# EAGLE schematic Avalon16 (EAGLE 5.12)
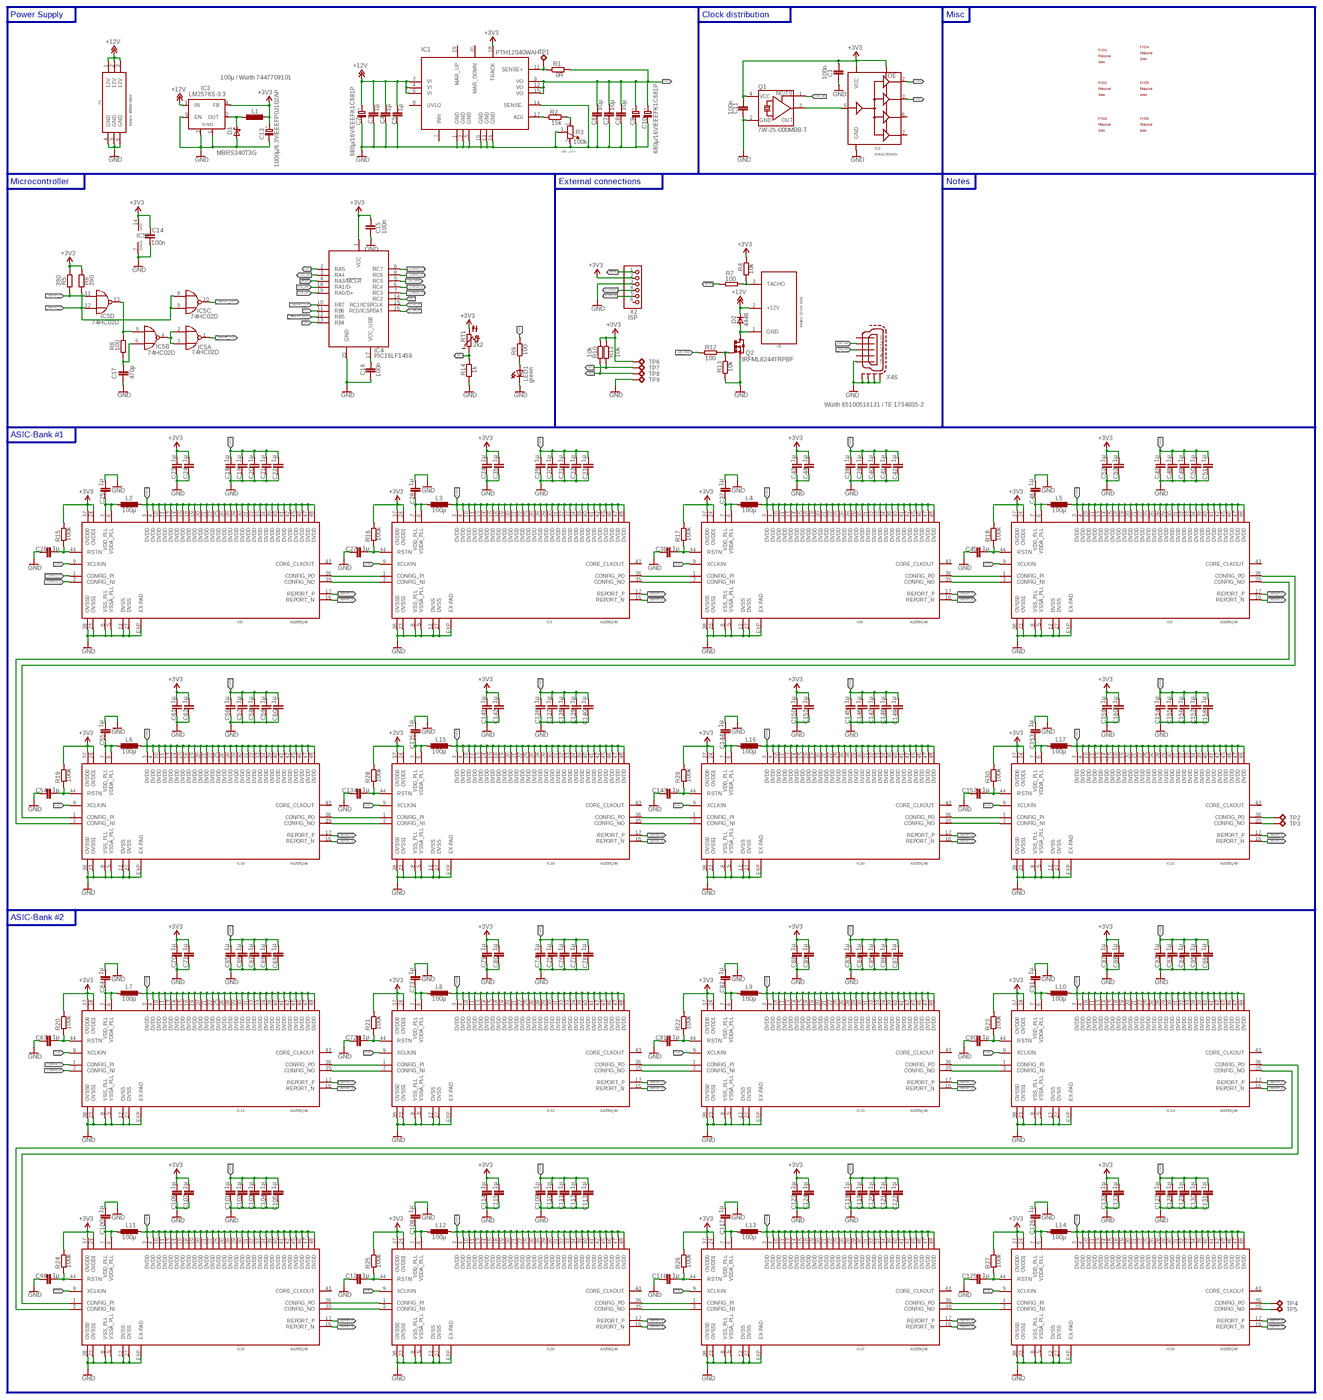
[diagram p0: schematic, sheet 1, overview]
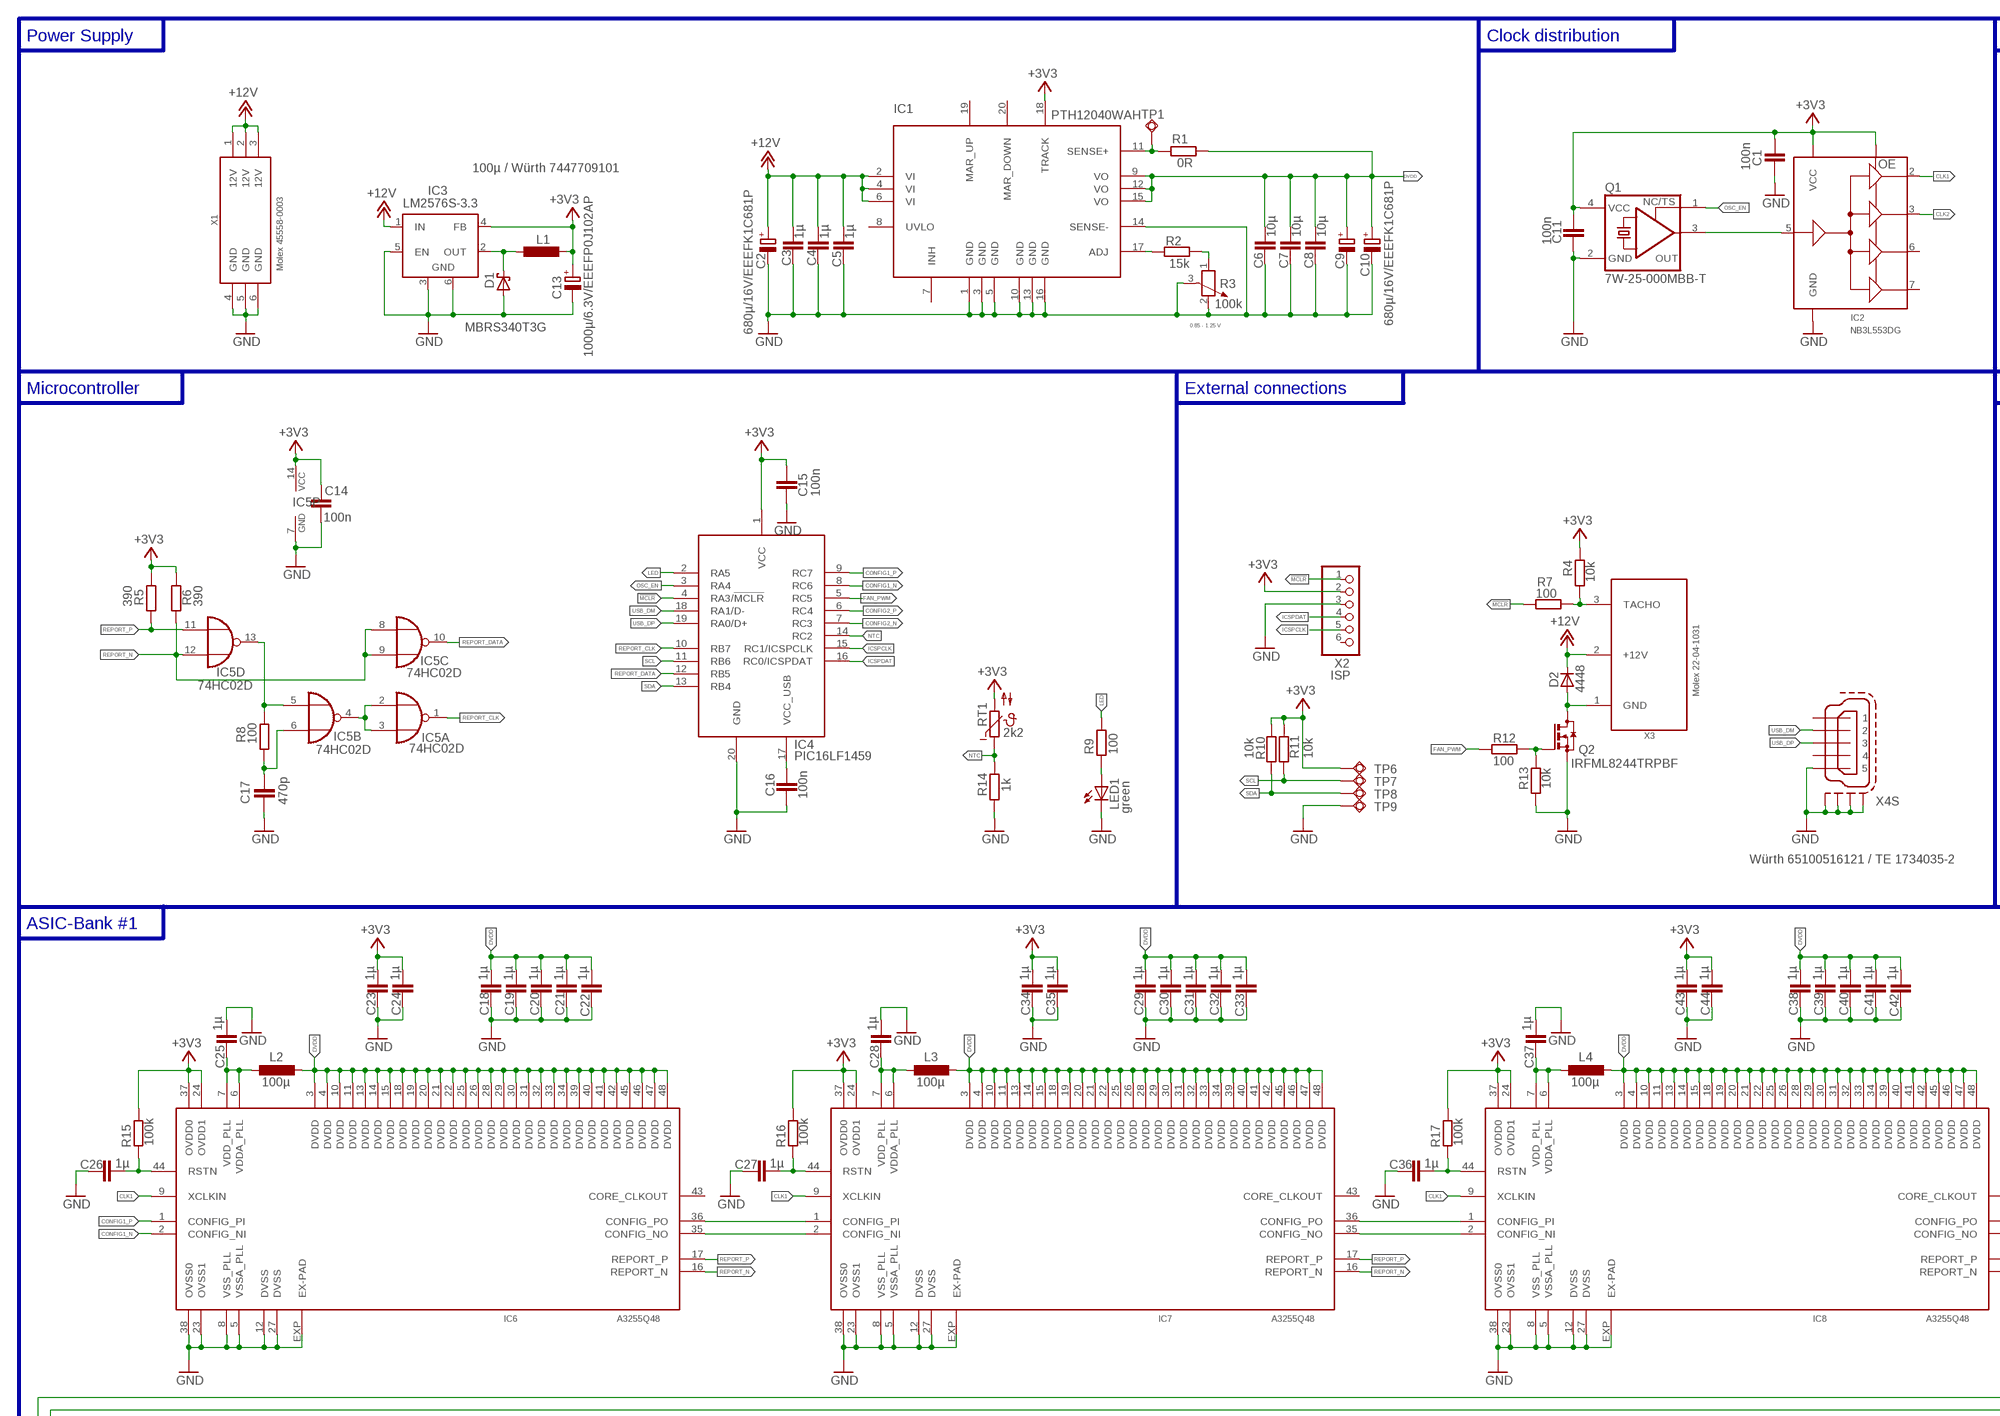
[diagram p1: schematic, sheet 1, part 1 of 4]
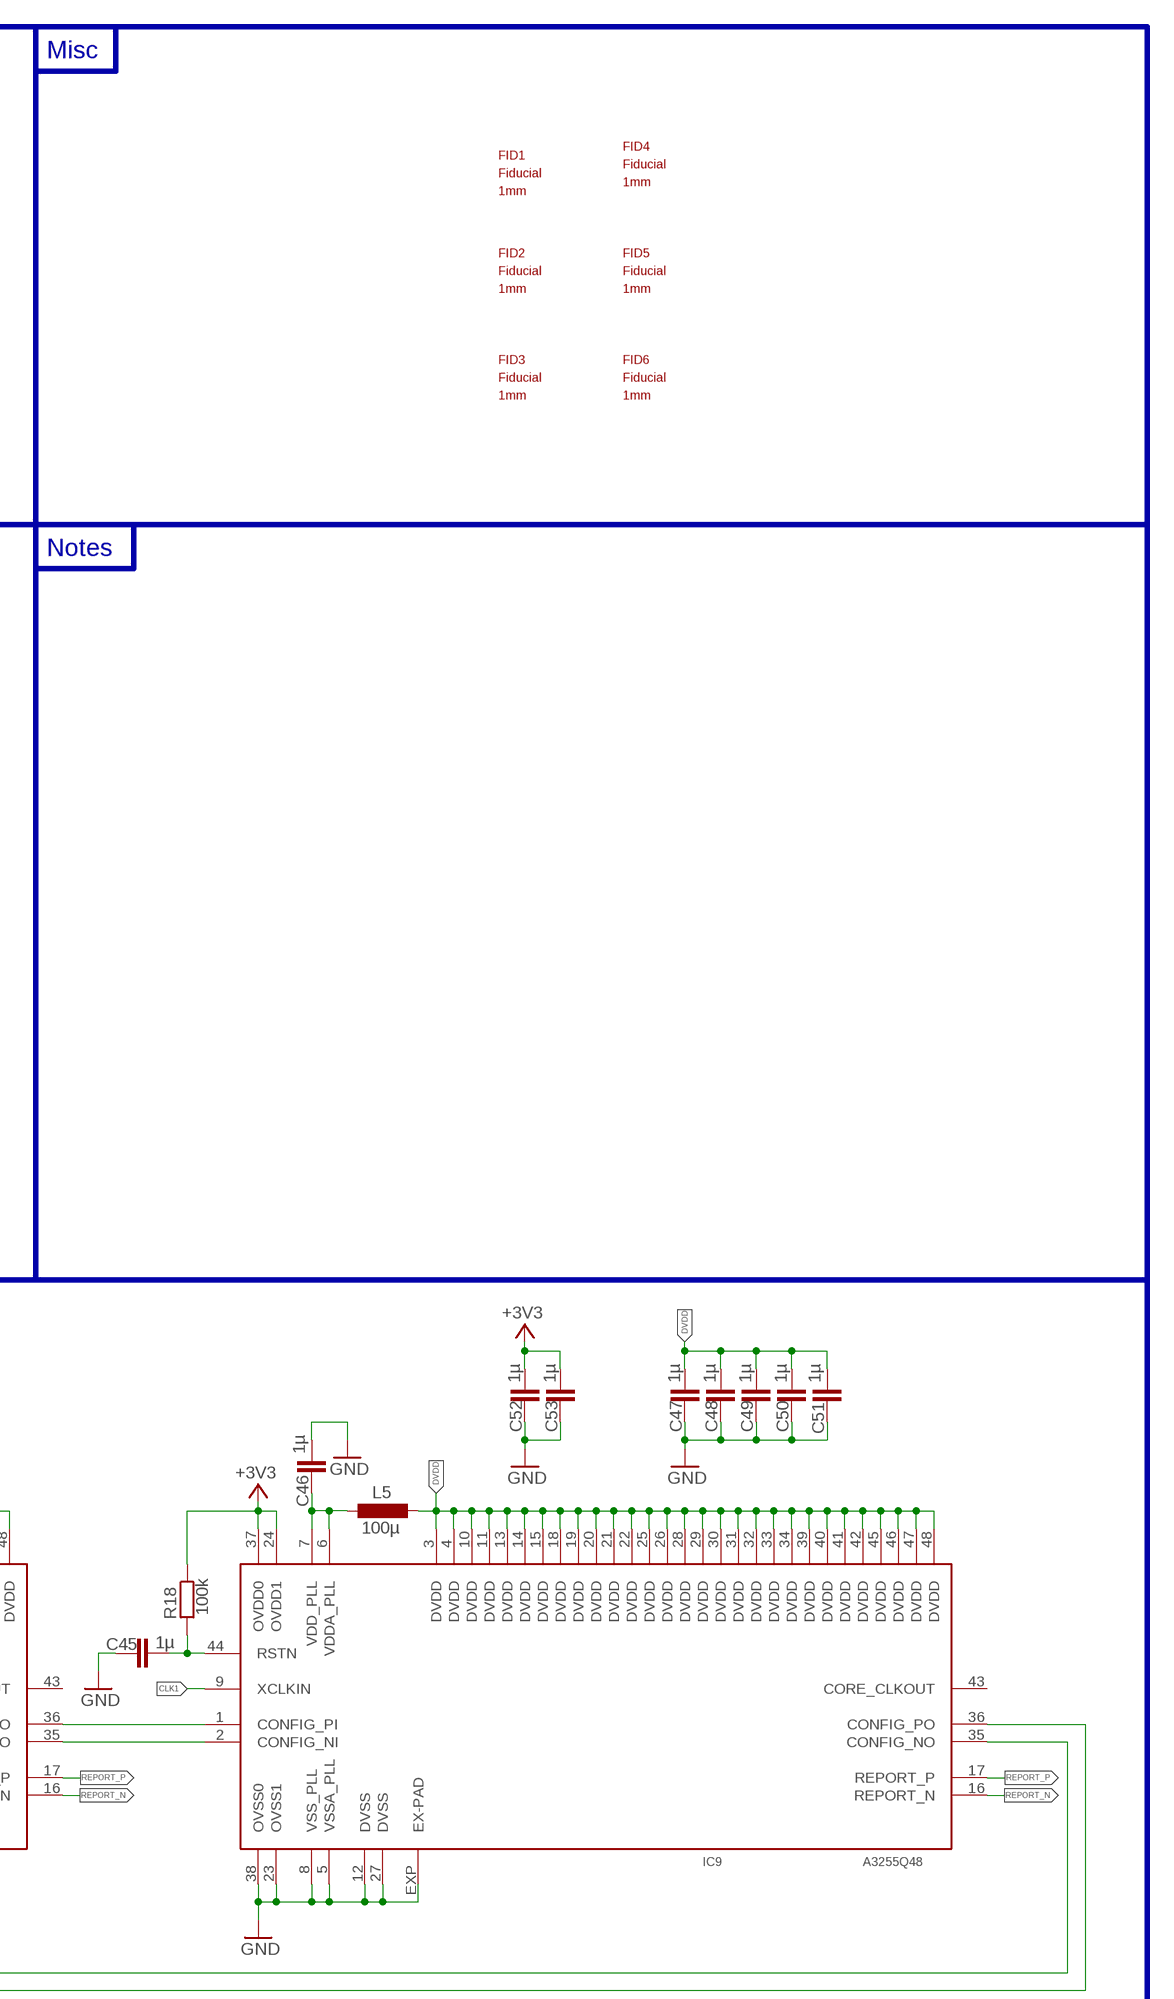
[diagram p2: schematic, sheet 1, part 2 of 4]
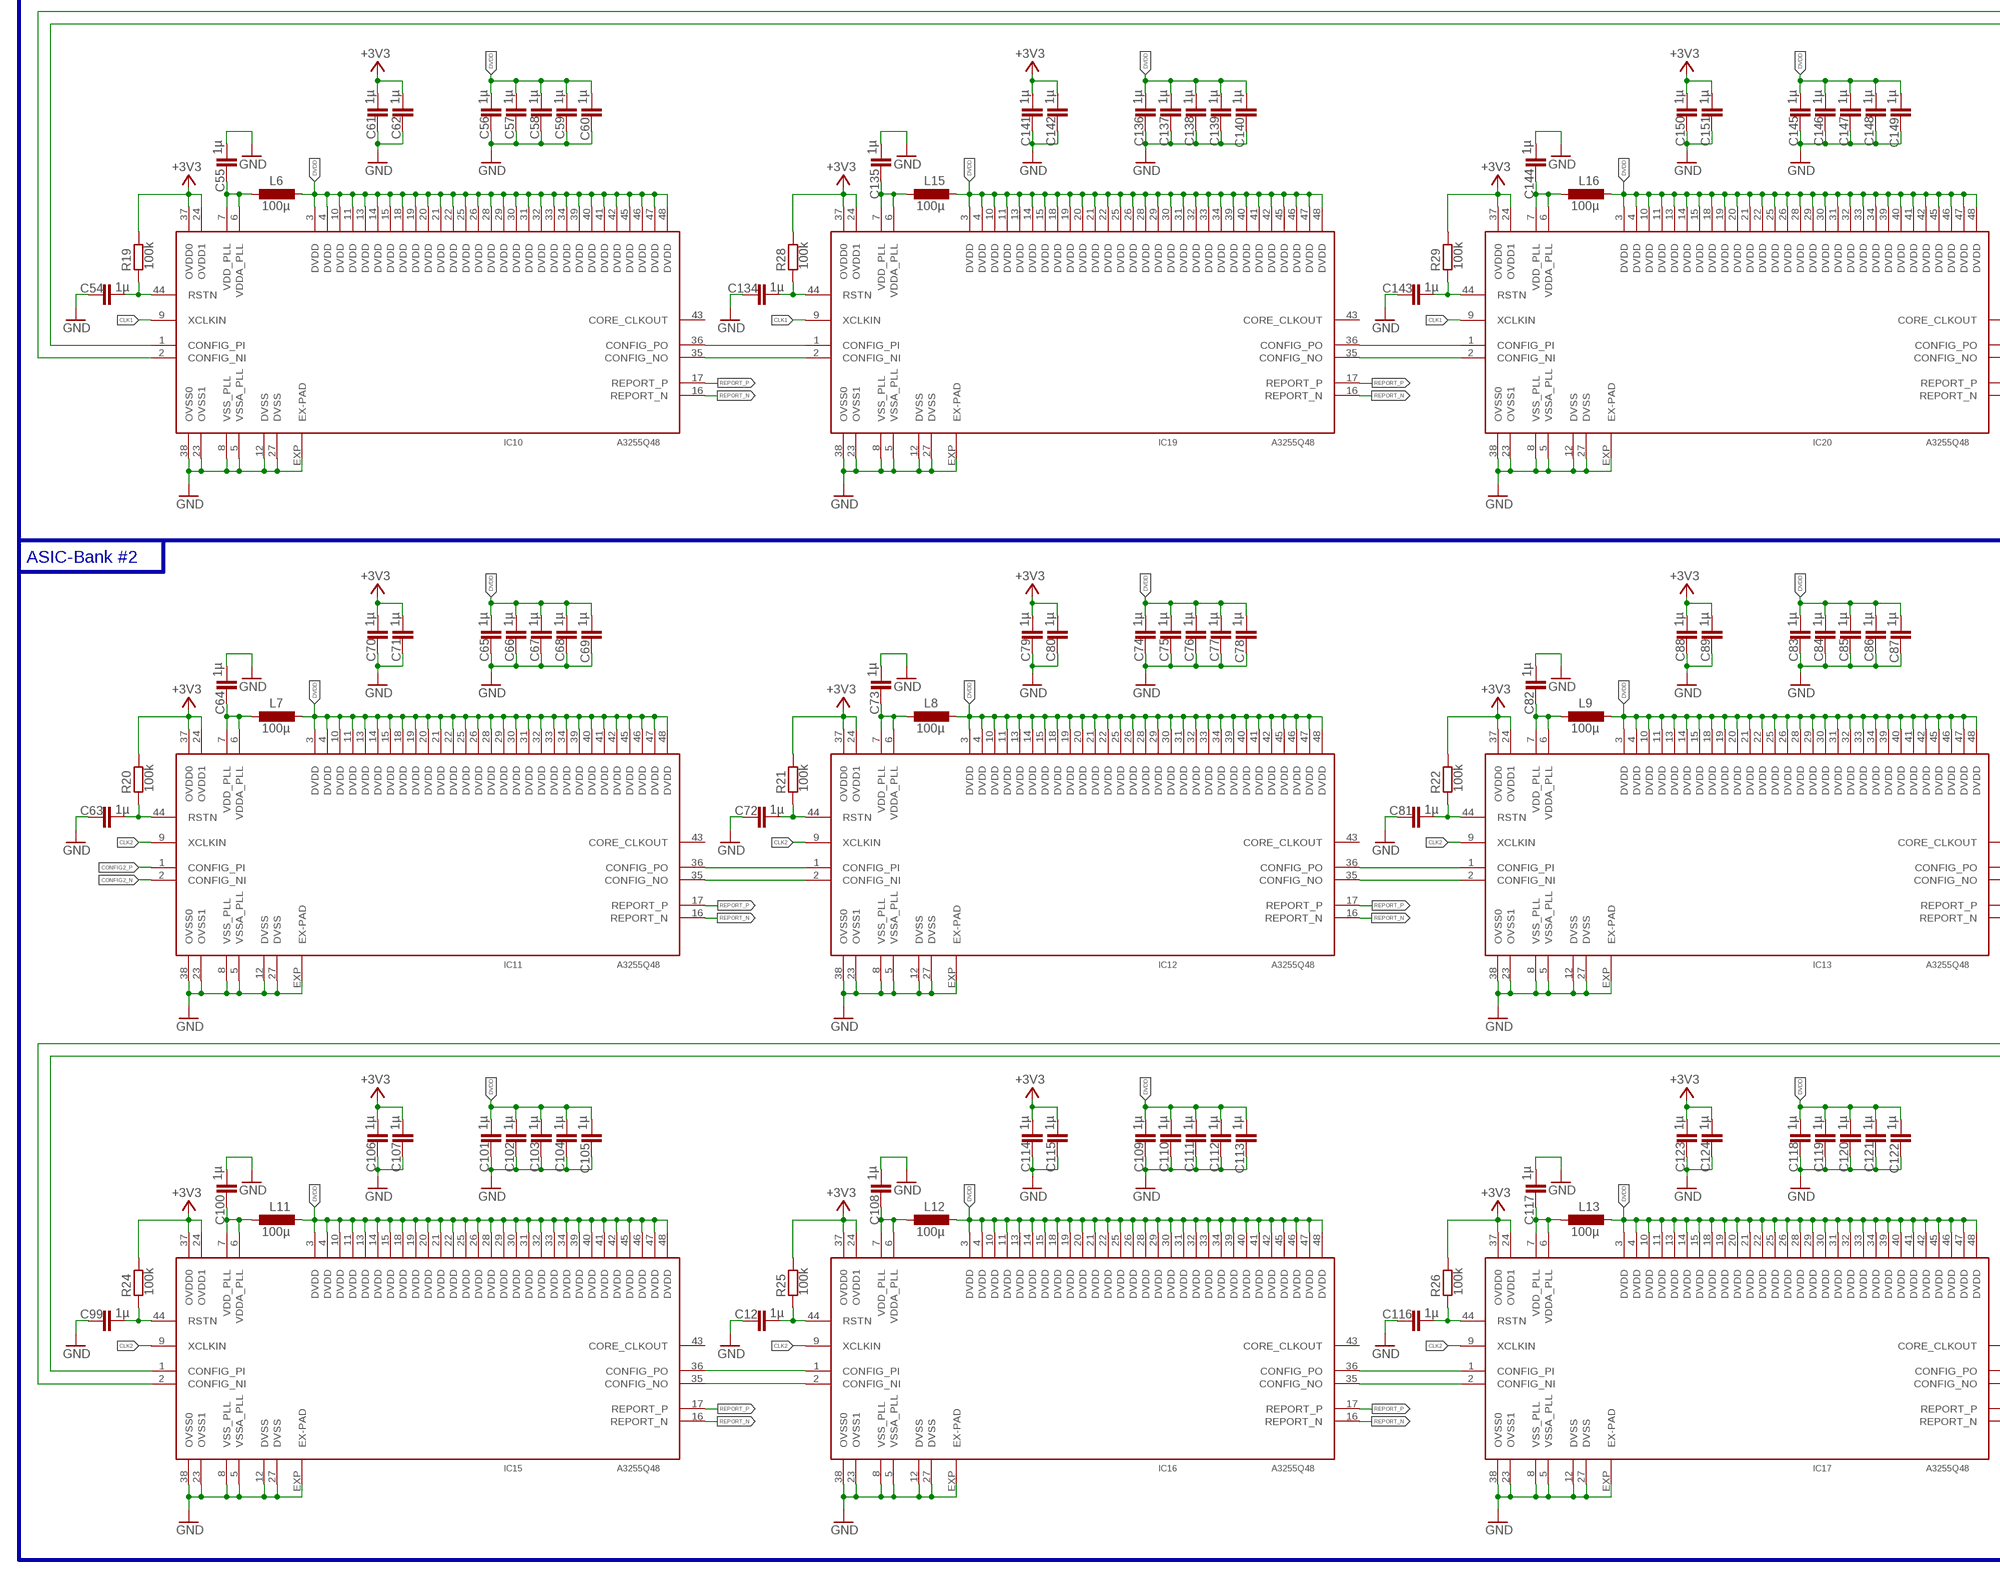
[diagram p3: schematic, sheet 1, part 3 of 4]
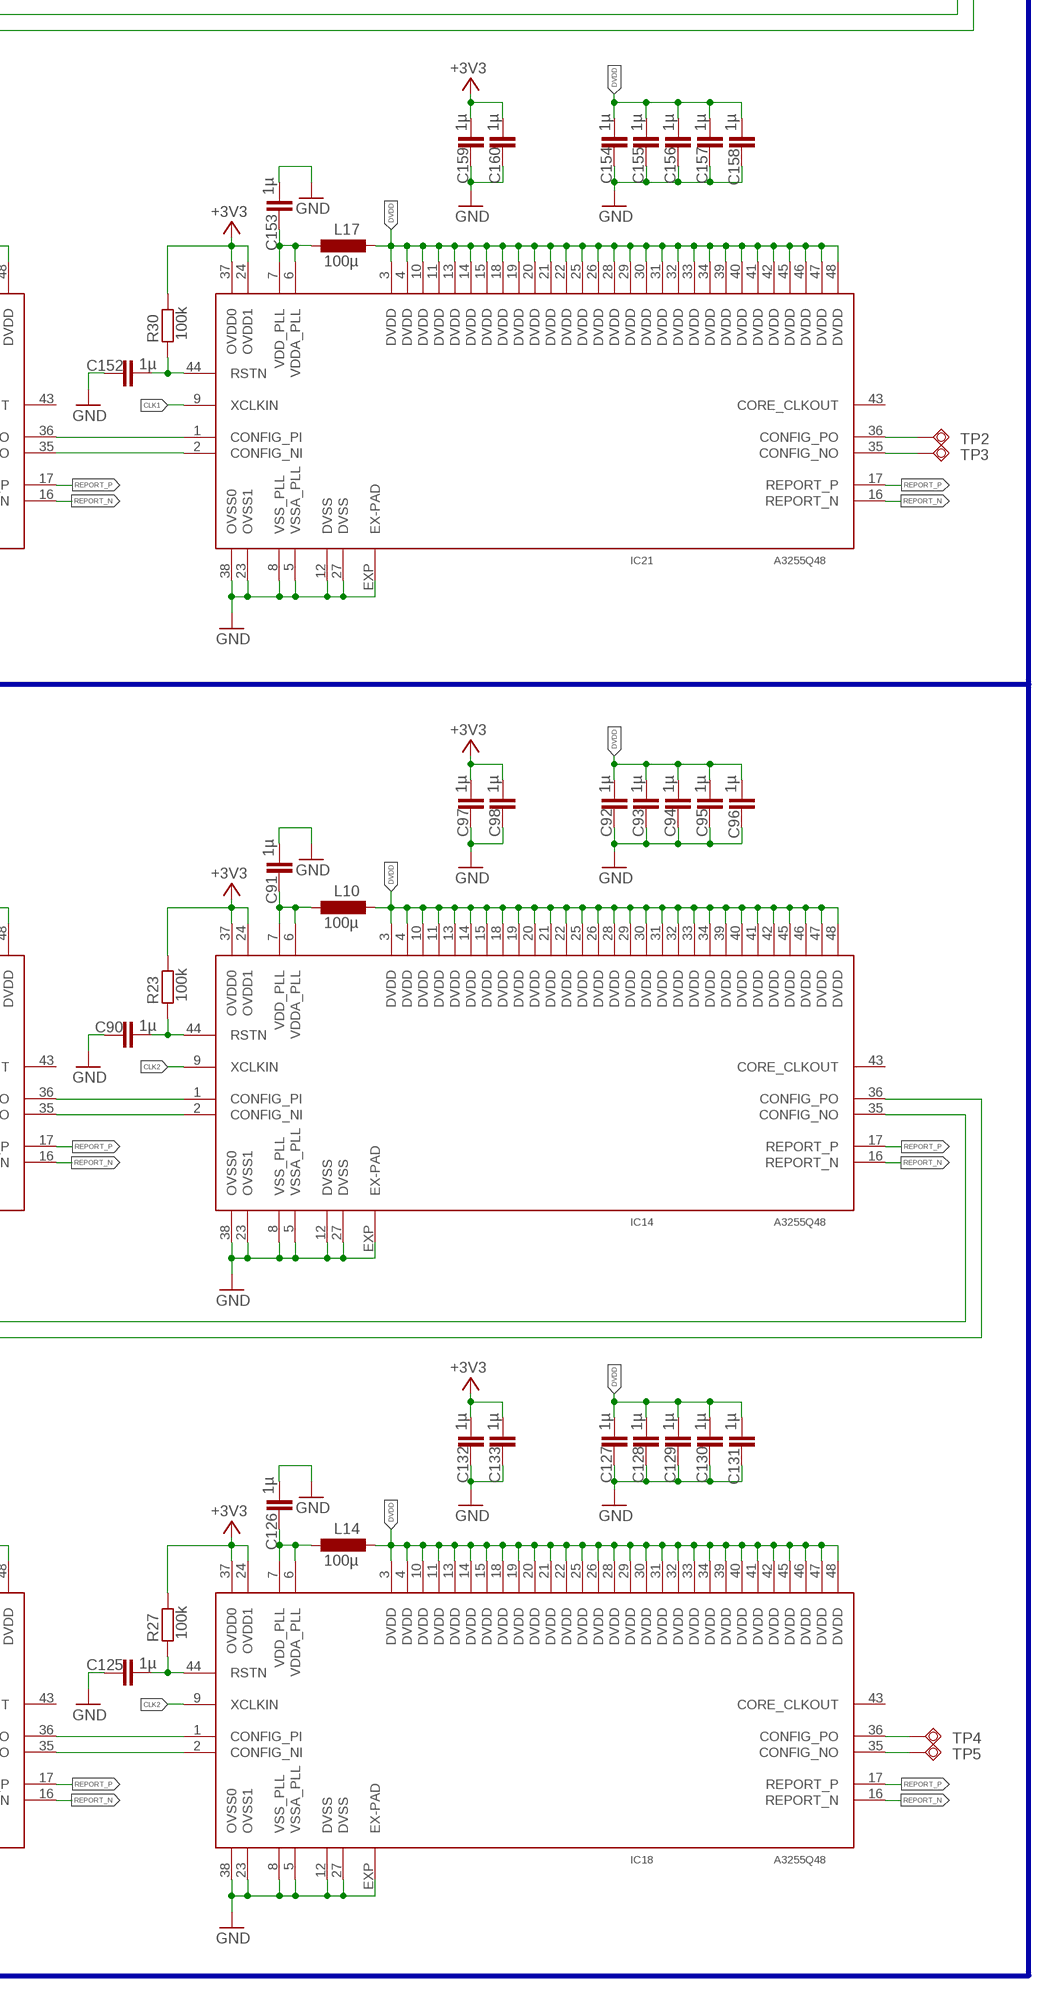
[diagram p4: schematic, sheet 1, part 4 of 4]

## Parts
C1  100n  C-EUC0805  [C0805]
C2  680µ/16V/EEEFK1C681P  CPOL-EUG  [PANASONIC_G]
C3  1µ  C-EUC0805  [C0805]
C4  1µ  C-EUC0805  [C0805]
C5  1µ  C-EUC0805  [C0805]
C6  10µ  C-EUC0805  [C0805]
C7  10µ  C-EUC0805  [C0805]
C8  10µ  C-EUC0805  [C0805]
C9  680µ/16V/EEEFK1C681P  CPOL-EUG  [PANASONIC_G]
C10  680µ/16V/EEEFK1C681P  CPOL-EUG  [PANASONIC_G]
C11  100n  C-EUC0805  [C0805]
C12  1µ  C-EUC0805  [C0805]
C13  1000µ/6.3V/EEEFP0J102AP  CPOL-EUF  [PANASONIC_F]
C14  100n  C-EUC0805  [C0805]
C15  100n  C-EUC0805  [C0805]
C16  100n  C-EUC0805  [C0805]
C17  470p  C-EUC0805  [C0805]
C18  1µ  C-EUC0805  [C0805]
C19  1µ  C-EUC0805  [C0805]
C20  1µ  C-EUC0805  [C0805]
C21  1µ  C-EUC0805  [C0805]
C22  1µ  C-EUC0805  [C0805]
C23  1µ  C-EUC0805  [C0805]
C24  1µ  C-EUC0805  [C0805]
C25  1µ  C-EUC0805  [C0805]
C26  1µ  C-EUC0805  [C0805]
C27  1µ  C-EUC0805  [C0805]
C28  1µ  C-EUC0805  [C0805]
C29  1µ  C-EUC0805  [C0805]
C30  1µ  C-EUC0805  [C0805]
C31  1µ  C-EUC0805  [C0805]
C32  1µ  C-EUC0805  [C0805]
C33  1µ  C-EUC0805  [C0805]
C34  1µ  C-EUC0805  [C0805]
C35  1µ  C-EUC0805  [C0805]
C36  1µ  C-EUC0805  [C0805]
C37  1µ  C-EUC0805  [C0805]
C38  1µ  C-EUC0805  [C0805]
C39  1µ  C-EUC0805  [C0805]
C40  1µ  C-EUC0805  [C0805]
C41  1µ  C-EUC0805  [C0805]
C42  1µ  C-EUC0805  [C0805]
C43  1µ  C-EUC0805  [C0805]
C44  1µ  C-EUC0805  [C0805]
C45  1µ  C-EUC0805  [C0805]
C46  1µ  C-EUC0805  [C0805]
C47  1µ  C-EUC0805  [C0805]
C48  1µ  C-EUC0805  [C0805]
C49  1µ  C-EUC0805  [C0805]
C50  1µ  C-EUC0805  [C0805]
C51  1µ  C-EUC0805  [C0805]
C52  1µ  C-EUC0805  [C0805]
C53  1µ  C-EUC0805  [C0805]
C54  1µ  C-EUC0805  [C0805]
C55  1µ  C-EUC0805  [C0805]
C56  1µ  C-EUC0805  [C0805]
C57  1µ  C-EUC0805  [C0805]
C58  1µ  C-EUC0805  [C0805]
C59  1µ  C-EUC0805  [C0805]
C60  1µ  C-EUC0805  [C0805]
C61  1µ  C-EUC0805  [C0805]
C62  1µ  C-EUC0805  [C0805]
C63  1µ  C-EUC0805  [C0805]
C64  1µ  C-EUC0805  [C0805]
C65  1µ  C-EUC0805  [C0805]
C66  1µ  C-EUC0805  [C0805]
C67  1µ  C-EUC0805  [C0805]
C68  1µ  C-EUC0805  [C0805]
C69  1µ  C-EUC0805  [C0805]
C70  1µ  C-EUC0805  [C0805]
C71  1µ  C-EUC0805  [C0805]
C72  1µ  C-EUC0805  [C0805]
C73  1µ  C-EUC0805  [C0805]
C74  1µ  C-EUC0805  [C0805]
C75  1µ  C-EUC0805  [C0805]
C76  1µ  C-EUC0805  [C0805]
C77  1µ  C-EUC0805  [C0805]
C78  1µ  C-EUC0805  [C0805]
C79  1µ  C-EUC0805  [C0805]
C80  1µ  C-EUC0805  [C0805]
C81  1µ  C-EUC0805  [C0805]
C82  1µ  C-EUC0805  [C0805]
C83  1µ  C-EUC0805  [C0805]
C84  1µ  C-EUC0805  [C0805]
C85  1µ  C-EUC0805  [C0805]
C86  1µ  C-EUC0805  [C0805]
C87  1µ  C-EUC0805  [C0805]
C88  1µ  C-EUC0805  [C0805]
C89  1µ  C-EUC0805  [C0805]
C90  1µ  C-EUC0805  [C0805]
C91  1µ  C-EUC0805  [C0805]
C92  1µ  C-EUC0805  [C0805]
C93  1µ  C-EUC0805  [C0805]
C94  1µ  C-EUC0805  [C0805]
C95  1µ  C-EUC0805  [C0805]
C96  1µ  C-EUC0805  [C0805]
C97  1µ  C-EUC0805  [C0805]
C98  1µ  C-EUC0805  [C0805]
C99  1µ  C-EUC0805  [C0805]
C100  1µ  C-EUC0805  [C0805]
C101  1µ  C-EUC0805  [C0805]
C102  1µ  C-EUC0805  [C0805]
C103  1µ  C-EUC0805  [C0805]
C104  1µ  C-EUC0805  [C0805]
C105  1µ  C-EUC0805  [C0805]
C106  1µ  C-EUC0805  [C0805]
C107  1µ  C-EUC0805  [C0805]
C108  1µ  C-EUC0805  [C0805]
C109  1µ  C-EUC0805  [C0805]
C110  1µ  C-EUC0805  [C0805]
C111  1µ  C-EUC0805  [C0805]
C112  1µ  C-EUC0805  [C0805]
C113  1µ  C-EUC0805  [C0805]
C114  1µ  C-EUC0805  [C0805]
C115  1µ  C-EUC0805  [C0805]
C116  1µ  C-EUC0805  [C0805]
C117  1µ  C-EUC0805  [C0805]
C118  1µ  C-EUC0805  [C0805]
C119  1µ  C-EUC0805  [C0805]
C120  1µ  C-EUC0805  [C0805]
C121  1µ  C-EUC0805  [C0805]
C122  1µ  C-EUC0805  [C0805]
C123  1µ  C-EUC0805  [C0805]
C124  1µ  C-EUC0805  [C0805]
C125  1µ  C-EUC0805  [C0805]
C126  1µ  C-EUC0805  [C0805]
C127  1µ  C-EUC0805  [C0805]
C128  1µ  C-EUC0805  [C0805]
C129  1µ  C-EUC0805  [C0805]
C130  1µ  C-EUC0805  [C0805]
C131  1µ  C-EUC0805  [C0805]
C132  1µ  C-EUC0805  [C0805]
C133  1µ  C-EUC0805  [C0805]
C134  1µ  C-EUC0805  [C0805]
C135  1µ  C-EUC0805  [C0805]
C136  1µ  C-EUC0805  [C0805]
C137  1µ  C-EUC0805  [C0805]
C138  1µ  C-EUC0805  [C0805]
C139  1µ  C-EUC0805  [C0805]
C140  1µ  C-EUC0805  [C0805]
C141  1µ  C-EUC0805  [C0805]
C142  1µ  C-EUC0805  [C0805]
C143  1µ  C-EUC0805  [C0805]
C144  1µ  C-EUC0805  [C0805]
C145  1µ  C-EUC0805  [C0805]
C146  1µ  C-EUC0805  [C0805]
C147  1µ  C-EUC0805  [C0805]
C148  1µ  C-EUC0805  [C0805]
C149  1µ  C-EUC0805  [C0805]
C150  1µ  C-EUC0805  [C0805]
C151  1µ  C-EUC0805  [C0805]
C152  1µ  C-EUC0805  [C0805]
C153  1µ  C-EUC0805  [C0805]
C154  1µ  C-EUC0805  [C0805]
C155  1µ  C-EUC0805  [C0805]
C156  1µ  C-EUC0805  [C0805]
C157  1µ  C-EUC0805  [C0805]
C158  1µ  C-EUC0805  [C0805]
C159  1µ  C-EUC0805  [C0805]
C160  1µ  C-EUC0805  [C0805]
D1  MBRS340T3G  SCHOTTKY-DIODESMC  [SMC]
D2  4448  PMLL41SOD80C  [SOD80C]
FID1  1mm  FIDUCIAL  [FIDUCIAL]
FID2  1mm  FIDUCIAL  [FIDUCIAL]
FID3  1mm  FIDUCIAL  [FIDUCIAL]
FID4  1mm  FIDUCIAL  [FIDUCIAL]
FID5  1mm  FIDUCIAL  [FIDUCIAL]
FID6  1mm  FIDUCIAL  [FIDUCIAL]
IC1  PTH12040WAH  [PTH12040WAH]
IC2  NB3L553DG  NB3L553  [SO8]
IC3  LM2576S-3.3  LM2596S  [TO263-5]
IC4  PIC16LF1459  [SOIC20]
IC5  74HC02D  [SO14]
IC6  A3255Q48  A3255  [QFN48]
IC7  A3255Q48  A3255  [QFN48]
IC8  A3255Q48  A3255  [QFN48]
IC9  A3255Q48  A3255  [QFN48]
IC10  A3255Q48  A3255  [QFN48]
IC11  A3255Q48  A3255  [QFN48]
IC12  A3255Q48  A3255  [QFN48]
IC13  A3255Q48  A3255  [QFN48]
IC14  A3255Q48  A3255  [QFN48]
IC15  A3255Q48  A3255  [QFN48]
IC16  A3255Q48  A3255  [QFN48]
IC17  A3255Q48  A3255  [QFN48]
IC18  A3255Q48  A3255  [QFN48]
IC19  A3255Q48  A3255  [QFN48]
IC20  A3255Q48  A3255  [QFN48]
IC21  A3255Q48  A3255  [QFN48]
L1  100µ / Würth 7447709101  WUERTH-7447709101  [WUERTH-7447709101]
L2  100µ  L-EUL0805  [L0805]
L3  100µ  L-EUL0805  [L0805]
L4  100µ  L-EUL0805  [L0805]
L5  100µ  L-EUL0805  [L0805]
L6  100µ  L-EUL0805  [L0805]
L7  100µ  L-EUL0805  [L0805]
L8  100µ  L-EUL0805  [L0805]
L9  100µ  L-EUL0805  [L0805]
L10  100µ  L-EUL0805  [L0805]
L11  100µ  L-EUL0805  [L0805]
L12  100µ  L-EUL0805  [L0805]
L13  100µ  L-EUL0805  [L0805]
L14  100µ  L-EUL0805  [L0805]
L15  100µ  L-EUL0805  [L0805]
L16  100µ  L-EUL0805  [L0805]
L17  100µ  L-EUL0805  [L0805]
LED1  green  LEDSML0805  [SML0805]
Q1  7W-25-000MBB-T  7W  [7W]
Q2  IRFML8244TRPBF  BSS123  [SOT23]
R1  0R  R-EU_R0805  [R0805]
R2  15k  R-EU_R0805  [R0805]
R3  100k  POTENTIOMETER_PT_SPIN  [PT-SPIN]
R4  10k  R-EU_R0805  [R0805]
R5  390  R-EU_R0805  [R0805]
R6  390  R-EU_R0805  [R0805]
R7  100  R-EU_R0805  [R0805]
R8  100  R-EU_R0805  [R0805]
R9  100  R-EU_R0805  [R0805]
R10  10k  R-EU_R0805  [R0805]
R11  10k  R-EU_R0805  [R0805]
R12  100  R-EU_R0805  [R0805]
R13  10k  R-EU_R0805  [R0805]
R14  1k  R-EU_R0805  [R0805]
R15  100k  R-EU_R0805  [R0805]
R16  100k  R-EU_R0805  [R0805]
R17  100k  R-EU_R0805  [R0805]
R18  100k  R-EU_R0805  [R0805]
R19  100k  R-EU_R0805  [R0805]
R20  100k  R-EU_R0805  [R0805]
R21  100k  R-EU_R0805  [R0805]
R22  100k  R-EU_R0805  [R0805]
R23  100k  R-EU_R0805  [R0805]
R24  100k  R-EU_R0805  [R0805]
R25  100k  R-EU_R0805  [R0805]
R26  100k  R-EU_R0805  [R0805]
R27  100k  R-EU_R0805  [R0805]
R28  100k  R-EU_R0805  [R0805]
R29  100k  R-EU_R0805  [R0805]
R30  100k  R-EU_R0805  [R0805]
RT1  2k2  NTC  [0805]
TP1  TPSQTP20SQ  [TP20SQ]
TP2  TPSQTP10SQ  [TP10SQ]
TP3  TPSQTP10SQ  [TP10SQ]
TP4  TPSQTP10SQ  [TP10SQ]
TP5  TPSQTP10SQ  [TP10SQ]
TP6  TPSQTP10SQ  [TP10SQ]
TP7  TPSQTP10SQ  [TP10SQ]
TP8  TPSQTP10SQ  [TP10SQ]
TP9  TPSQTP10SQ  [TP10SQ]
X1  Molex 45558-0003  MOLEX-45558-0003  [MOLEX-45558-0003]
X2  ISP  PINHD-1X6/270  [1X06/270]
X3  Molex 22-04-1031  MOLEX-22-04-1031  [MOLEX-22-04-1031]
X4  Würth 65100516121 / TE 1734035-2  MINI-USB-SCHIELD-32005-301  [32005-301]

## Nets
!MCLR: IC4.4(RA3/!MCLR) R7.1 X2.1
!RESET1: C26.2 IC6.44(RSTN) R15.2
!RESET2: C27.2 IC7.44(RSTN) R16.2
!RESET3: C36.2 IC8.44(RSTN) R17.2
!RESET4: C45.2 IC9.44(RSTN) R18.2
!RESET5: C54.2 IC10.44(RSTN) R19.2
!RESET6: C63.2 IC11.44(RSTN) R20.2
!RESET7: C72.2 IC12.44(RSTN) R21.2
!RESET8: C81.2 IC13.44(RSTN) R22.2
!RESET9: C90.2 IC14.44(RSTN) R23.2
!RESET10: C99.2 IC15.44(RSTN) R24.2
!RESET11: C12.2 IC16.44(RSTN) R25.2
!RESET12: C116.2 IC17.44(RSTN) R26.2
!RESET13: C125.2 IC18.44(RSTN) R27.2
!RESET14: C134.2 IC19.44(RSTN) R28.2
!RESET15: C143.2 IC20.44(RSTN) R29.2
!RESET16: C152.2 IC21.44(RSTN) R30.2
+3V3: C1.2 C11.2 C13.+ C14.2 C15.2 C23.2 C24.2 C34.2 C35.2 C43.2 C44.2 C52.2 C53.2 C61.2 C62.2 C70.2 C71.2 C79.2 C80.2 C88.2 C89.2 C97.2 C98.2 C106.2 C107.2 C114.2 C115.2 C123.2 C124.2 C132.2 C133.2 C141.2 C142.2 C150.2 C151.2 C159.2 C160.2 IC1.18(TRACK) IC2.1(VCC) IC2.8(OE) IC3.4(FB) IC4.1(VCC) IC5.14(P:VCC) IC6.24(OVDD1) IC6.37(OVDD0) IC7.24(OVDD1) IC7.37(OVDD0) IC8.24(OVDD1) IC8.37(OVDD0) IC9.24(OVDD1) IC9.37(OVDD0) IC10.24(OVDD1) IC10.37(OVDD0) IC11.24(OVDD1) IC11.37(OVDD0) IC12.24(OVDD1) IC12.37(OVDD0) IC13.24(OVDD1) IC13.37(OVDD0) IC14.24(OVDD1) IC14.37(OVDD0) IC15.24(OVDD1) IC15.37(OVDD0) IC16.24(OVDD1) IC16.37(OVDD0) IC17.24(OVDD1) IC17.37(OVDD0) IC18.24(OVDD1) IC18.37(OVDD0) IC19.24(OVDD1) IC19.37(OVDD0) IC20.24(OVDD1) IC20.37(OVDD0) IC21.24(OVDD1) IC21.37(OVDD0) L1.2 Q1.4(VCC) R4.1 R5.1 R6.1 R10.1 R11.1 R15.1 R16.1 R17.1 R18.1 R19.1 R20.1 R21.1 R22.1 R23.1 R24.1 R25.1 R26.1 R27.1 R28.1 R29.1 R30.1 RT1.2 TP6.TP X2.2
+12V: C2.+ C3.1 C4.1 C5.1 D2.C IC1.2(VI) IC1.4(VI) IC1.6(VI) IC3.1(IN) X1.1(12V) X1.2(12V) X1.3(12V) X3.2(+12V)
CLK1: IC2.2(OUT1) IC6.9(XCLKIN) IC7.9(XCLKIN) IC8.9(XCLKIN) IC9.9(XCLKIN) IC10.9(XCLKIN) IC19.9(XCLKIN) IC20.9(XCLKIN) IC21.9(XCLKIN)
CLK2: IC2.3(OUT2) IC11.9(XCLKIN) IC12.9(XCLKIN) IC13.9(XCLKIN) IC14.9(XCLKIN) IC15.9(XCLKIN) IC16.9(XCLKIN) IC17.9(XCLKIN) IC18.9(XCLKIN)
CONFIG1_1_2_N: IC6.35(CONFIG_NO) IC7.2(CONFIG_NI)
CONFIG1_1_2_P: IC6.36(CONFIG_PO) IC7.1(CONFIG_PI)
CONFIG1_2_3_N: IC7.35(CONFIG_NO) IC8.2(CONFIG_NI)
CONFIG1_2_3_P: IC7.36(CONFIG_PO) IC8.1(CONFIG_PI)
CONFIG1_3_4_N: IC8.35(CONFIG_NO) IC9.2(CONFIG_NI)
CONFIG1_3_4_P: IC8.36(CONFIG_PO) IC9.1(CONFIG_PI)
CONFIG1_4_5_N: IC9.35(CONFIG_NO) IC10.2(CONFIG_NI)
CONFIG1_4_5_P: IC9.36(CONFIG_PO) IC10.1(CONFIG_PI)
CONFIG1_5_6_N: IC10.35(CONFIG_NO) IC19.2(CONFIG_NI)
CONFIG1_5_6_P: IC10.36(CONFIG_PO) IC19.1(CONFIG_PI)
CONFIG1_6_7_N: IC19.35(CONFIG_NO) IC20.2(CONFIG_NI)
CONFIG1_6_7_P: IC19.36(CONFIG_PO) IC20.1(CONFIG_PI)
CONFIG1_7_8_N: IC20.35(CONFIG_NO) IC21.2(CONFIG_NI)
CONFIG1_7_8_P: IC20.36(CONFIG_PO) IC21.1(CONFIG_PI)
CONFIG1_8_N: IC21.35(CONFIG_NO) TP3.TP
CONFIG1_8_P: IC21.36(CONFIG_PO) TP2.TP
CONFIG1_N: IC4.8(RC6) IC6.2(CONFIG_NI)
CONFIG1_P: IC4.9(RC7) IC6.1(CONFIG_PI)
CONFIG2_1_2_N: IC11.35(CONFIG_NO) IC12.2(CONFIG_NI)
CONFIG2_1_2_P: IC11.36(CONFIG_PO) IC12.1(CONFIG_PI)
CONFIG2_2_3_N: IC12.35(CONFIG_NO) IC13.2(CONFIG_NI)
CONFIG2_2_3_P: IC12.36(CONFIG_PO) IC13.1(CONFIG_PI)
CONFIG2_3_4_N: IC13.35(CONFIG_NO) IC14.2(CONFIG_NI)
CONFIG2_3_4_P: IC13.36(CONFIG_PO) IC14.1(CONFIG_PI)
CONFIG2_4_5_N: IC14.35(CONFIG_NO) IC15.2(CONFIG_NI)
CONFIG2_4_5_P: IC14.36(CONFIG_PO) IC15.1(CONFIG_PI)
CONFIG2_5_6_N: IC15.35(CONFIG_NO) IC16.2(CONFIG_NI)
CONFIG2_5_6_P: IC15.36(CONFIG_PO) IC16.1(CONFIG_PI)
CONFIG2_6_7_N: IC16.35(CONFIG_NO) IC17.2(CONFIG_NI)
CONFIG2_6_7_P: IC16.36(CONFIG_PO) IC17.1(CONFIG_PI)
CONFIG2_7_8_N: IC17.35(CONFIG_NO) IC18.2(CONFIG_NI)
CONFIG2_7_8_P: IC17.36(CONFIG_PO) IC18.1(CONFIG_PI)
CONFIG2_8_N: IC18.35(CONFIG_NO) TP5.TP
CONFIG2_8_P: IC18.36(CONFIG_PO) TP4.TP
CONFIG2_N: IC4.7(RC3) IC11.2(CONFIG_NI)
CONFIG2_P: IC4.6(RC4) IC11.1(CONFIG_PI)
DVDD: C6.1 C7.1 C8.1 C9.+ C10.+ C18.2 C19.2 C20.2 C21.2 C22.2 C29.2 C30.2 C31.2 C32.2 C33.2 C38.2 C39.2 C40.2 C41.2 C42.2 C47.2 C48.2 C49.2 C50.2 C51.2 C56.2 C57.2 C58.2 C59.2 C60.2 C65.2 C66.2 C67.2 C68.2 C69.2 C74.2 C75.2 C76.2 C77.2 C78.2 C83.2 C84.2 C85.2 C86.2 C87.2 C92.2 C93.2 C94.2 C95.2 C96.2 C101.2 C102.2 C103.2 C104.2 C105.2 C109.2 C110.2 C111.2 C112.2 C113.2 C118.2 C119.2 C120.2 C121.2 C122.2 C127.2 C128.2 C129.2 C130.2 C131.2 C136.2 C137.2 C138.2 C139.2 C140.2 C145.2 C146.2 C147.2 C148.2 C149.2 C154.2 C155.2 C156.2 C157.2 C158.2 IC1.9(VO) IC1.12(VO) IC1.15(VO) IC6.3(DVDD) IC6.4(DVDD) IC6.10(DVDD) IC6.11(DVDD) IC6.13(DVDD) IC6.14(DVDD) IC6.15(DVDD) IC6.18(DVDD) IC6.19(DVDD) IC6.20(DVDD) IC6.21(DVDD) IC6.22(DVDD) IC6.25(DVDD) IC6.26(DVDD) IC6.28(DVDD) IC6.29(DVDD) IC6.30(DVDD) IC6.31(DVDD) IC6.32(DVDD) IC6.33(DVDD) IC6.34(DVDD) IC6.39(DVDD) IC6.40(DVDD) IC6.41(DVDD) IC6.42(DVDD) IC6.45(DVDD) IC6.46(DVDD) IC6.47(DVDD) IC6.48(DVDD) IC7.3(DVDD) IC7.4(DVDD) IC7.10(DVDD) IC7.11(DVDD) IC7.13(DVDD) IC7.14(DVDD) IC7.15(DVDD) IC7.18(DVDD) IC7.19(DVDD) IC7.20(DVDD) IC7.21(DVDD) IC7.22(DVDD) IC7.25(DVDD) IC7.26(DVDD) IC7.28(DVDD) IC7.29(DVDD) IC7.30(DVDD) IC7.31(DVDD) IC7.32(DVDD) IC7.33(DVDD) IC7.34(DVDD) IC7.39(DVDD) IC7.40(DVDD) IC7.41(DVDD) IC7.42(DVDD) IC7.45(DVDD) IC7.46(DVDD) IC7.47(DVDD) IC7.48(DVDD) IC8.3(DVDD) IC8.4(DVDD) IC8.10(DVDD) IC8.11(DVDD) IC8.13(DVDD) IC8.14(DVDD) IC8.15(DVDD) IC8.18(DVDD) IC8.19(DVDD) IC8.20(DVDD) IC8.21(DVDD) IC8.22(DVDD) IC8.25(DVDD) IC8.26(DVDD) IC8.28(DVDD) IC8.29(DVDD) IC8.30(DVDD) IC8.31(DVDD) IC8.32(DVDD) IC8.33(DVDD) IC8.34(DVDD) IC8.39(DVDD) IC8.40(DVDD) IC8.41(DVDD) IC8.42(DVDD) IC8.45(DVDD) IC8.46(DVDD) IC8.47(DVDD) IC8.48(DVDD) IC9.3(DVDD) IC9.4(DVDD) IC9.10(DVDD) IC9.11(DVDD) IC9.13(DVDD) IC9.14(DVDD) IC9.15(DVDD) IC9.18(DVDD) IC9.19(DVDD) IC9.20(DVDD) IC9.21(DVDD) IC9.22(DVDD) IC9.25(DVDD) IC9.26(DVDD) IC9.28(DVDD) IC9.29(DVDD) IC9.30(DVDD) IC9.31(DVDD) IC9.32(DVDD) IC9.33(DVDD) IC9.34(DVDD) IC9.39(DVDD) IC9.40(DVDD) IC9.41(DVDD) IC9.42(DVDD) IC9.45(DVDD) IC9.46(DVDD) IC9.47(DVDD) IC9.48(DVDD) IC10.3(DVDD) IC10.4(DVDD) IC10.10(DVDD) IC10.11(DVDD) IC10.13(DVDD) IC10.14(DVDD) IC10.15(DVDD) IC10.18(DVDD) IC10.19(DVDD) IC10.20(DVDD) IC10.21(DVDD) IC10.22(DVDD) IC10.25(DVDD) IC10.26(DVDD) IC10.28(DVDD) IC10.29(DVDD) IC10.30(DVDD) IC10.31(DVDD) IC10.32(DVDD) IC10.33(DVDD) IC10.34(DVDD) IC10.39(DVDD) IC10.40(DVDD) IC10.41(DVDD) IC10.42(DVDD) IC10.45(DVDD) IC10.46(DVDD) IC10.47(DVDD) IC10.48(DVDD) IC11.3(DVDD) IC11.4(DVDD) IC11.10(DVDD) IC11.11(DVDD) IC11.13(DVDD) IC11.14(DVDD) IC11.15(DVDD) IC11.18(DVDD) IC11.19(DVDD) IC11.20(DVDD) IC11.21(DVDD) IC11.22(DVDD) IC11.25(DVDD) IC11.26(DVDD) IC11.28(DVDD) IC11.29(DVDD) IC11.30(DVDD) IC11.31(DVDD) IC11.32(DVDD) IC11.33(DVDD) IC11.34(DVDD) IC11.39(DVDD) IC11.40(DVDD) IC11.41(DVDD) IC11.42(DVDD) IC11.45(DVDD) IC11.46(DVDD) IC11.47(DVDD) IC11.48(DVDD) IC12.3(DVDD) IC12.4(DVDD) IC12.10(DVDD) IC12.11(DVDD) IC12.13(DVDD) IC12.14(DVDD) IC12.15(DVDD) IC12.18(DVDD) IC12.19(DVDD) IC12.20(DVDD) IC12.21(DVDD) IC12.22(DVDD) IC12.25(DVDD) IC12.26(DVDD) IC12.28(DVDD) IC12.29(DVDD) IC12.30(DVDD) IC12.31(DVDD) IC12.32(DVDD) IC12.33(DVDD) IC12.34(DVDD) IC12.39(DVDD) IC12.40(DVDD) IC12.41(DVDD) IC12.42(DVDD) IC12.45(DVDD) IC12.46(DVDD) IC12.47(DVDD) IC12.48(DVDD) IC13.3(DVDD) IC13.4(DVDD) IC13.10(DVDD) IC13.11(DVDD) IC13.13(DVDD) IC13.14(DVDD) IC13.15(DVDD) IC13.18(DVDD) IC13.19(DVDD) IC13.20(DVDD) IC13.21(DVDD) IC13.22(DVDD) IC13.25(DVDD) IC13.26(DVDD) IC13.28(DVDD) IC13.29(DVDD) IC13.30(DVDD) IC13.31(DVDD) IC13.32(DVDD) IC13.33(DVDD) IC13.34(DVDD) IC13.39(DVDD) IC13.40(DVDD) IC13.41(DVDD) IC13.42(DVDD) IC13.45(DVDD) IC13.46(DVDD) IC13.47(DVDD) IC13.48(DVDD) IC14.3(DVDD) IC14.4(DVDD) IC14.10(DVDD) IC14.11(DVDD) IC14.13(DVDD) IC14.14(DVDD) IC14.15(DVDD) IC14.18(DVDD) IC14.19(DVDD) IC14.20(DVDD) IC14.21(DVDD) IC14.22(DVDD) IC14.25(DVDD) IC14.26(DVDD) IC14.28(DVDD) IC14.29(DVDD) IC14.30(DVDD) IC14.31(DVDD) IC14.32(DVDD) IC14.33(DVDD) IC14.34(DVDD) IC14.39(DVDD) IC14.40(DVDD) IC14.41(DVDD) IC14.42(DVDD) IC14.45(DVDD) IC14.46(DVDD) IC14.47(DVDD) IC14.48(DVDD) IC15.3(DVDD) IC15.4(DVDD) IC15.10(DVDD) IC15.11(DVDD) IC15.13(DVDD) IC15.14(DVDD) IC15.15(DVDD) IC15.18(DVDD) IC15.19(DVDD) IC15.20(DVDD) IC15.21(DVDD) IC15.22(DVDD) IC15.25(DVDD) IC15.26(DVDD) IC15.28(DVDD) IC15.29(DVDD) IC15.30(DVDD) IC15.31(DVDD) IC15.32(DVDD) IC15.33(DVDD) IC15.34(DVDD) IC15.39(DVDD) IC15.40(DVDD) IC15.41(DVDD) IC15.42(DVDD) IC15.45(DVDD) IC15.46(DVDD) IC15.47(DVDD) IC15.48(DVDD) IC16.3(DVDD) IC16.4(DVDD) IC16.10(DVDD) IC16.11(DVDD) IC16.13(DVDD) IC16.14(DVDD) IC16.15(DVDD) IC16.18(DVDD) IC16.19(DVDD) IC16.20(DVDD) IC16.21(DVDD) IC16.22(DVDD) IC16.25(DVDD) IC16.26(DVDD) IC16.28(DVDD) IC16.29(DVDD) IC16.30(DVDD) IC16.31(DVDD) IC16.32(DVDD) IC16.33(DVDD) IC16.34(DVDD) IC16.39(DVDD) IC16.40(DVDD) IC16.41(DVDD) IC16.42(DVDD) IC16.45(DVDD) IC16.46(DVDD) IC16.47(DVDD) IC16.48(DVDD) IC17.3(DVDD) IC17.4(DVDD) IC17.10(DVDD) IC17.11(DVDD) IC17.13(DVDD) IC17.14(DVDD) IC17.15(DVDD) IC17.18(DVDD) IC17.19(DVDD) IC17.20(DVDD) IC17.21(DVDD) IC17.22(DVDD) IC17.25(DVDD) IC17.26(DVDD) IC17.28(DVDD) IC17.29(DVDD) IC17.30(DVDD) IC17.31(DVDD) IC17.32(DVDD) IC17.33(DVDD) IC17.34(DVDD) IC17.39(DVDD) IC17.40(DVDD) IC17.41(DVDD) IC17.42(DVDD) IC17.45(DVDD) IC17.46(DVDD) IC17.47(DVDD) IC17.48(DVDD) IC18.3(DVDD) IC18.4(DVDD) IC18.10(DVDD) IC18.11(DVDD) IC18.13(DVDD) IC18.14(DVDD) IC18.15(DVDD) IC18.18(DVDD) IC18.19(DVDD) IC18.20(DVDD) IC18.21(DVDD) IC18.22(DVDD) IC18.25(DVDD) IC18.26(DVDD) IC18.28(DVDD) IC18.29(DVDD) IC18.30(DVDD) IC18.31(DVDD) IC18.32(DVDD) IC18.33(DVDD) IC18.34(DVDD) IC18.39(DVDD) IC18.40(DVDD) IC18.41(DVDD) IC18.42(DVDD) IC18.45(DVDD) IC18.46(DVDD) IC18.47(DVDD) IC18.48(DVDD) IC19.3(DVDD) IC19.4(DVDD) IC19.10(DVDD) IC19.11(DVDD) IC19.13(DVDD) IC19.14(DVDD) IC19.15(DVDD) IC19.18(DVDD) IC19.19(DVDD) IC19.20(DVDD) IC19.21(DVDD) IC19.22(DVDD) IC19.25(DVDD) IC19.26(DVDD) IC19.28(DVDD) IC19.29(DVDD) IC19.30(DVDD) IC19.31(DVDD) IC19.32(DVDD) IC19.33(DVDD) IC19.34(DVDD) IC19.39(DVDD) IC19.40(DVDD) IC19.41(DVDD) IC19.42(DVDD) IC19.45(DVDD) IC19.46(DVDD) IC19.47(DVDD) IC19.48(DVDD) IC20.3(DVDD) IC20.4(DVDD) IC20.10(DVDD) IC20.11(DVDD) IC20.13(DVDD) IC20.14(DVDD) IC20.15(DVDD) IC20.18(DVDD) IC20.19(DVDD) IC20.20(DVDD) IC20.21(DVDD) IC20.22(DVDD) IC20.25(DVDD) IC20.26(DVDD) IC20.28(DVDD) IC20.29(DVDD) IC20.30(DVDD) IC20.31(DVDD) IC20.32(DVDD) IC20.33(DVDD) IC20.34(DVDD) IC20.39(DVDD) IC20.40(DVDD) IC20.41(DVDD) IC20.42(DVDD) IC20.45(DVDD) IC20.46(DVDD) IC20.47(DVDD) IC20.48(DVDD) IC21.3(DVDD) IC21.4(DVDD) IC21.10(DVDD) IC21.11(DVDD) IC21.13(DVDD) IC21.14(DVDD) IC21.15(DVDD) IC21.18(DVDD) IC21.19(DVDD) IC21.20(DVDD) IC21.21(DVDD) IC21.22(DVDD) IC21.25(DVDD) IC21.26(DVDD) IC21.28(DVDD) IC21.29(DVDD) IC21.30(DVDD) IC21.31(DVDD) IC21.32(DVDD) IC21.33(DVDD) IC21.34(DVDD) IC21.39(DVDD) IC21.40(DVDD) IC21.41(DVDD) IC21.42(DVDD) IC21.45(DVDD) IC21.46(DVDD) IC21.47(DVDD) IC21.48(DVDD) L2.1 L3.1 L4.1 L5.1 L6.1 L7.1 L8.1 L9.1 L10.1 L11.1 L12.1 L13.1 L14.1 L15.1 L16.1 L17.1 R1.2
FAN_PWM: IC4.5(RC5) R12.1
GND: C1.1 C2.- C3.2 C4.2 C5.2 C6.2 C7.2 C8.2 C9.- C10.- C11.1 C12.1 C13.- C14.1 C15.1 C16.1 C17.1 C18.1 C19.1 C20.1 C21.1 C22.1 C23.1 C24.1 C25.2 C26.1 C27.1 C28.2 C29.1 C30.1 C31.1 C32.1 C33.1 C34.1 C35.1 C36.1 C37.2 C38.1 C39.1 C40.1 C41.1 C42.1 C43.1 C44.1 C45.1 C46.2 C47.1 C48.1 C49.1 C50.1 C51.1 C52.1 C53.1 C54.1 C55.2 C56.1 C57.1 C58.1 C59.1 C60.1 C61.1 C62.1 C63.1 C64.2 C65.1 C66.1 C67.1 C68.1 C69.1 C70.1 C71.1 C72.1 C73.2 C74.1 C75.1 C76.1 C77.1 C78.1 C79.1 C80.1 C81.1 C82.2 C83.1 C84.1 C85.1 C86.1 C87.1 C88.1 C89.1 C90.1 C91.2 C92.1 C93.1 C94.1 C95.1 C96.1 C97.1 C98.1 C99.1 C100.2 C101.1 C102.1 C103.1 C104.1 C105.1 C106.1 C107.1 C108.2 C109.1 C110.1 C111.1 C112.1 C113.1 C114.1 C115.1 C116.1 C117.2 C118.1 C119.1 C120.1 C121.1 C122.1 C123.1 C124.1 C125.1 C126.2 C127.1 C128.1 C129.1 C130.1 C131.1 C132.1 C133.1 C134.1 C135.2 C136.1 C137.1 C138.1 C139.1 C140.1 C141.1 C142.1 C143.1 C144.2 C145.1 C146.1 C147.1 C148.1 C149.1 C150.1 C151.1 C152.1 C153.2 C154.1 C155.1 C156.1 C157.1 C158.1 C159.1 C160.1 D1.A IC1.1(GND) IC1.3(GND) IC1.5(GND) IC1.10(GND) IC1.13(GND) IC1.14(SENSE-) IC1.16(GND) IC2.4(GND) IC3.3(GND) IC3.5(EN) IC3.6(GND) IC4.20(GND) IC5.7(P:GND) IC6.5(VSSA_PLL) IC6.8(VSS_PLL) IC6.12(DVSS) IC6.23(OVSS1) IC6.27(DVSS) IC6.38(OVSS0) IC6.EXP(EX-PAD) IC7.5(VSSA_PLL) IC7.8(VSS_PLL) IC7.12(DVSS) IC7.23(OVSS1) IC7.27(DVSS) IC7.38(OVSS0) IC7.EXP(EX-PAD) IC8.5(VSSA_PLL) IC8.8(VSS_PLL) IC8.12(DVSS) IC8.23(OVSS1) IC8.27(DVSS) IC8.38(OVSS0) IC8.EXP(EX-PAD) IC9.5(VSSA_PLL) IC9.8(VSS_PLL) IC9.12(DVSS) IC9.23(OVSS1) IC9.27(DVSS) IC9.38(OVSS0) IC9.EXP(EX-PAD) IC10.5(VSSA_PLL) IC10.8(VSS_PLL) IC10.12(DVSS) IC10.23(OVSS1) IC10.27(DVSS) IC10.38(OVSS0) IC10.EXP(EX-PAD) IC11.5(VSSA_PLL) IC11.8(VSS_PLL) IC11.12(DVSS) IC11.23(OVSS1) IC11.27(DVSS) IC11.38(OVSS0) IC11.EXP(EX-PAD) IC12.5(VSSA_PLL) IC12.8(VSS_PLL) IC12.12(DVSS) IC12.23(OVSS1) IC12.27(DVSS) IC12.38(OVSS0) IC12.EXP(EX-PAD) IC13.5(VSSA_PLL) IC13.8(VSS_PLL) IC13.12(DVSS) IC13.23(OVSS1) IC13.27(DVSS) IC13.38(OVSS0) IC13.EXP(EX-PAD) IC14.5(VSSA_PLL) IC14.8(VSS_PLL) IC14.12(DVSS) IC14.23(OVSS1) IC14.27(DVSS) IC14.38(OVSS0) IC14.EXP(EX-PAD) IC15.5(VSSA_PLL) IC15.8(VSS_PLL) IC15.12(DVSS) IC15.23(OVSS1) IC15.27(DVSS) IC15.38(OVSS0) IC15.EXP(EX-PAD) IC16.5(VSSA_PLL) IC16.8(VSS_PLL) IC16.12(DVSS) IC16.23(OVSS1) IC16.27(DVSS) IC16.38(OVSS0) IC16.EXP(EX-PAD) IC17.5(VSSA_PLL) IC17.8(VSS_PLL) IC17.12(DVSS) IC17.23(OVSS1) IC17.27(DVSS) IC17.38(OVSS0) IC17.EXP(EX-PAD) IC18.5(VSSA_PLL) IC18.8(VSS_PLL) IC18.12(DVSS) IC18.23(OVSS1) IC18.27(DVSS) IC18.38(OVSS0) IC18.EXP(EX-PAD) IC19.5(VSSA_PLL) IC19.8(VSS_PLL) IC19.12(DVSS) IC19.23(OVSS1) IC19.27(DVSS) IC19.38(OVSS0) IC19.EXP(EX-PAD) IC20.5(VSSA_PLL) IC20.8(VSS_PLL) IC20.12(DVSS) IC20.23(OVSS1) IC20.27(DVSS) IC20.38(OVSS0) IC20.EXP(EX-PAD) IC21.5(VSSA_PLL) IC21.8(VSS_PLL) IC21.12(DVSS) IC21.23(OVSS1) IC21.27(DVSS) IC21.38(OVSS0) IC21.EXP(EX-PAD) LED1.C Q1.2(GND) Q2.2(S) R3.2 R3.3 R13.2 R14.2 TP9.TP X1.4(GND) X1.5(GND) X1.6(GND) X2.3 X4.5 X4.M1(S:S1) X4.M2(S:S2) X4.M3(S:S3) X4.M4(S:S4)
ICSPCLK: IC4.15(RC1/ICSPCLK) X2.5
ICSPDAT: IC4.16(RC0/ICSPDAT) X2.4
LED: IC4.2(RA5) R9.2
N$41: C16.2 IC4.17(VCC_USB)
N$42: IC1.17(ADJ) R2.1
N$43: R2.2 R3.1
N$44: D1.C IC3.2(OUT) L1.1
N$45: IC2.5(IN) Q1.3(OUT)
N$46: D2.A Q2.3(D) X3.1(GND)
N$47: IC5.5(B:I0) IC5.13(D:O) R8.1
N$48: IC5.2(A:I0) IC5.3(A:I1) IC5.4(B:O)
N$49: Q2.1(G) R12.2 R13.1
N$51: C17.2 IC5.6(B:I1) R8.2
N$55: R4.2 R7.2 X3.3(TACHO)
N$56: LED1.A R9.1
NTC: IC4.14(RC2) R14.1 RT1.1
OSC_EN: IC4.3(RA4) Q1.1(TS)
REPORT_CLK: IC4.10(RB7) IC5.1(A:O)
REPORT_DATA: IC4.12(RB5) IC5.10(C:O)
REPORT_N: IC5.8(C:I0) IC5.9(C:I1) IC5.12(D:I1) IC6.16(REPORT_N) IC7.16(REPORT_N) IC8.16(REPORT_N) IC9.16(REPORT_N) IC10.16(REPORT_N) IC11.16(REPORT_N) IC12.16(REPORT_N) IC13.16(REPORT_N) IC14.16(REPORT_N) IC15.16(REPORT_N) IC16.16(REPORT_N) IC17.16(REPORT_N) IC18.16(REPORT_N) IC19.16(REPORT_N) IC20.16(REPORT_N) IC21.16(REPORT_N) R6.2
REPORT_P: IC5.11(D:I0) IC6.17(REPORT_P) IC7.17(REPORT_P) IC8.17(REPORT_P) IC9.17(REPORT_P) IC10.17(REPORT_P) IC11.17(REPORT_P) IC12.17(REPORT_P) IC13.17(REPORT_P) IC14.17(REPORT_P) IC15.17(REPORT_P) IC16.17(REPORT_P) IC17.17(REPORT_P) IC18.17(REPORT_P) IC19.17(REPORT_P) IC20.17(REPORT_P) IC21.17(REPORT_P) R5.2
SCL: IC4.11(RB6) R11.2 TP7.TP
SDA: IC4.13(RB4) R10.2 TP8.TP
SENSE_VCC_D1: IC1.11(SENSE+) R1.1 TP1.TP
USB_DM: IC4.18(RA1/D-) X4.2
USB_DP: IC4.19(RA0/D+) X4.3
VDD_PLL1: C25.1 IC6.6(VDDA_PLL) IC6.7(VDD_PLL) L2.2
VDD_PLL2: C28.1 IC7.6(VDDA_PLL) IC7.7(VDD_PLL) L3.2
VDD_PLL3: C37.1 IC8.6(VDDA_PLL) IC8.7(VDD_PLL) L4.2
VDD_PLL4: C46.1 IC9.6(VDDA_PLL) IC9.7(VDD_PLL) L5.2
VDD_PLL5: C55.1 IC10.6(VDDA_PLL) IC10.7(VDD_PLL) L6.2
VDD_PLL6: C64.1 IC11.6(VDDA_PLL) IC11.7(VDD_PLL) L7.2
VDD_PLL7: C73.1 IC12.6(VDDA_PLL) IC12.7(VDD_PLL) L8.2
VDD_PLL8: C82.1 IC13.6(VDDA_PLL) IC13.7(VDD_PLL) L9.2
VDD_PLL9: C91.1 IC14.6(VDDA_PLL) IC14.7(VDD_PLL) L10.2
VDD_PLL10: C100.1 IC15.6(VDDA_PLL) IC15.7(VDD_PLL) L11.2
VDD_PLL11: C108.1 IC16.6(VDDA_PLL) IC16.7(VDD_PLL) L12.2
VDD_PLL12: C117.1 IC17.6(VDDA_PLL) IC17.7(VDD_PLL) L13.2
VDD_PLL13: C126.1 IC18.6(VDDA_PLL) IC18.7(VDD_PLL) L14.2
VDD_PLL14: C135.1 IC19.6(VDDA_PLL) IC19.7(VDD_PLL) L15.2
VDD_PLL15: C144.1 IC20.6(VDDA_PLL) IC20.7(VDD_PLL) L16.2
VDD_PLL16: C153.1 IC21.6(VDDA_PLL) IC21.7(VDD_PLL) L17.2
Unconnected: IC1.7(INH) IC1.8(UVLO) IC1.19(MAR_UP) IC1.20(MAR_DOWN) IC2.6(OUT3) IC2.7(OUT4) IC6.43(CORE_CLKOUT) IC7.43(CORE_CLKOUT) IC8.43(CORE_CLKOUT) IC9.43(CORE_CLKOUT) IC10.43(CORE_CLKOUT) IC11.43(CORE_CLKOUT) IC12.43(CORE_CLKOUT) IC13.43(CORE_CLKOUT) IC14.43(CORE_CLKOUT) IC15.43(CORE_CLKOUT) IC16.43(CORE_CLKOUT) IC17.43(CORE_CLKOUT) IC18.43(CORE_CLKOUT) IC19.43(CORE_CLKOUT) IC20.43(CORE_CLKOUT) IC21.43(CORE_CLKOUT) X2.6 X4.1 X4.4

## Buses
B$1

## Notes on the sheet
- Power Supply | Clock distribution | Misc
- 0.85 - 1.25 V
- Microcontroller | External connections | Notes
- ASIC-Bank #1
- ASIC-Bank #2

## Library data of the parts
C1 C3-C8 C11 C12 C14-C160 = rcl:C-EU: CAPACITOR, European symbol
C2 C9 C10 C13 = rcl:CPOL-EU: POLARIZED CAPACITOR, European symbol
D1 = diode:SCHOTTKY-DIODE: Schottky Diode
D2 = diode:PMLL41*: High-speed diodes Source: http://www.semiconductors.philips.com/acrobat_download/datasheets/PMLL4150_2.pdf
FID1-FID6 = fiducial:FIDUCIAL: SMD Passermarke
IC1 = PTH12040WAH:PTH12040WAH
IC2 = NB3L553:NB3L553
IC3 = linear:LM2596S: STEP-DOWN VOLTAGE REGULATOR
IC4 = PIC16LF1459:PIC16LF1459
IC5 = 74xx-eu:74*02: Quad 2-input NOR gate
IC6-IC21 = Avalon:A3255
L1 = Wuerth-7447709101:WUERTH-7447709101
L2-L17 = rcl:L-EU: INDUCTOR, European symbol
LED1 = led:LED: LED OSRAM: - CHIPLED LG R971, LG N971, LY N971, LG Q971, LY Q971, LO R971, LY R971 LH N974, LH R974 LS Q976, LO Q976, LY Q976 LO Q996 - Hyper CHIPLED LW Q18S LB Q993, LB Q99A, LB R99A - SideLED LS A670, LO A670, LY A670, LG A670, LP A670 LB A673, LV A673, LT A673, LW A673 LH A674 LY A675 LS A676, LA A676, LO A676, LY A676, LW A676 LS A679, LY A679, LG A679 - Hyper Micro SIDELED® LS Y876, LA Y876, LO Y876, LY Y876 LT Y87S - SmartLED LW L88C, LW L88S LB L89C, LB L89S, LG L890 LS L89K, LO L89K, LY L89K LS L896, LA L896, LO L896, LY L896 - TOPLED LS T670, LO T670, LY T670, LG T670, LP T670 LSG T670, LSP T670, LSY T670, LOP T670, LYG T670 LG T671, LOG T671, LSG T671 LB T673, LV T673, LT T673, LW T673 LH T674 LS T676, LA T676, LO T676, LY T676, LB T676, LH T676, LSB T676, LW T676 LB T67C, LV T67C, LT T67C, LS T67K, LO T67K, LY T67K, LW E67C LS E67B, LA E67B, LO E67B, LY E67B, LB E67C, LV E67C, LT E67C LW T67C LS T679, LY T679, LG T679 LS T770, LO T770, LY T770, LG T770, LP T770 LB T773, LV T773, LT T773, LW T773 LH T774 LS E675, LA E675, LY E675, LS T675 LS T776, LA T776, LO T776, LY T776, LB T776 LHGB T686 LT T68C, LB T68C - Hyper Mini TOPLED® LB M676 - Mini TOPLED Santana® LG M470 LS M47K, LO M47K, LY M47K Source: http://www.osram.convergy.de LUXEON: - LUMILED® LXK2-PW12-R00, LXK2-PW12-S00, LXK2-PW14-U00, LXK2-PW14-V00 LXK2-PM12-R00, LXK2-PM12-S00, LXK2-PM14-U00 LXK2-PE12-Q00, LXK2-PE12-R00, LXK2-PE12-S00, LXK2-PE14-T00, LXK2-PE14-U00 LXK2-PB12-K00, LXK2-PB12-L00, LXK2-PB12-M00, LXK2-PB14-N00, LXK2-PB14-P00, LXK2-PB14-Q00 LXK2-PR12-L00, LXK2-PR12-M00, LXK2-PR14-Q00, LXK2-PR14-R00 LXK2-PD12-Q00, LXK2-PD12-R00, LXK2-PD12-S00 LXK2-PH12-R00, LXK2-PH12-S00 LXK2-PL12-P00, LXK2-PL12-Q00, LXK2-PL12-R00 Source: www.luxeon.com KINGBRIGHT: KA-3528ASYC Source: www.kingbright.com
Q1 = Osc-7W:7W
Q2 = transistor-small-signal:BSS123: N-CHANNEL MOS FET
R1 R2 R4-R30 = rcl:R-EU_: RESISTOR, European symbol
R3 = rcl:POTENTIOMETER_: Potentiometer
RT1 = NTC:NTC
TP1-TP9 = testpad:TPSQ: Test pad
X1 = Molex-ATX-PCIe:MOLEX-45558-0003
X2 = pinhead:PINHD-1X6: PIN HEADER
X3 = Molex-ATX-PCIe:MOLEX-22-04-1031
X4 = con-cypressindustries:MINI-USB-SCHIELD-: MINI USB-B Conector Source: www.cypressindustries.com; OC_FARNELL: unknown; OC_NEWARK: unknown